# Altium schematic sheet pca10171_connectors.SchDoc: =BoardTitle + ' - Connectors'
size A3; Organization: Nordic Semiconductor; DocumentNumber: 7; SheetNumber: 7; SheetTotal: 10; CompanyName: Nordic Semiconductor; DocumentSize: A3
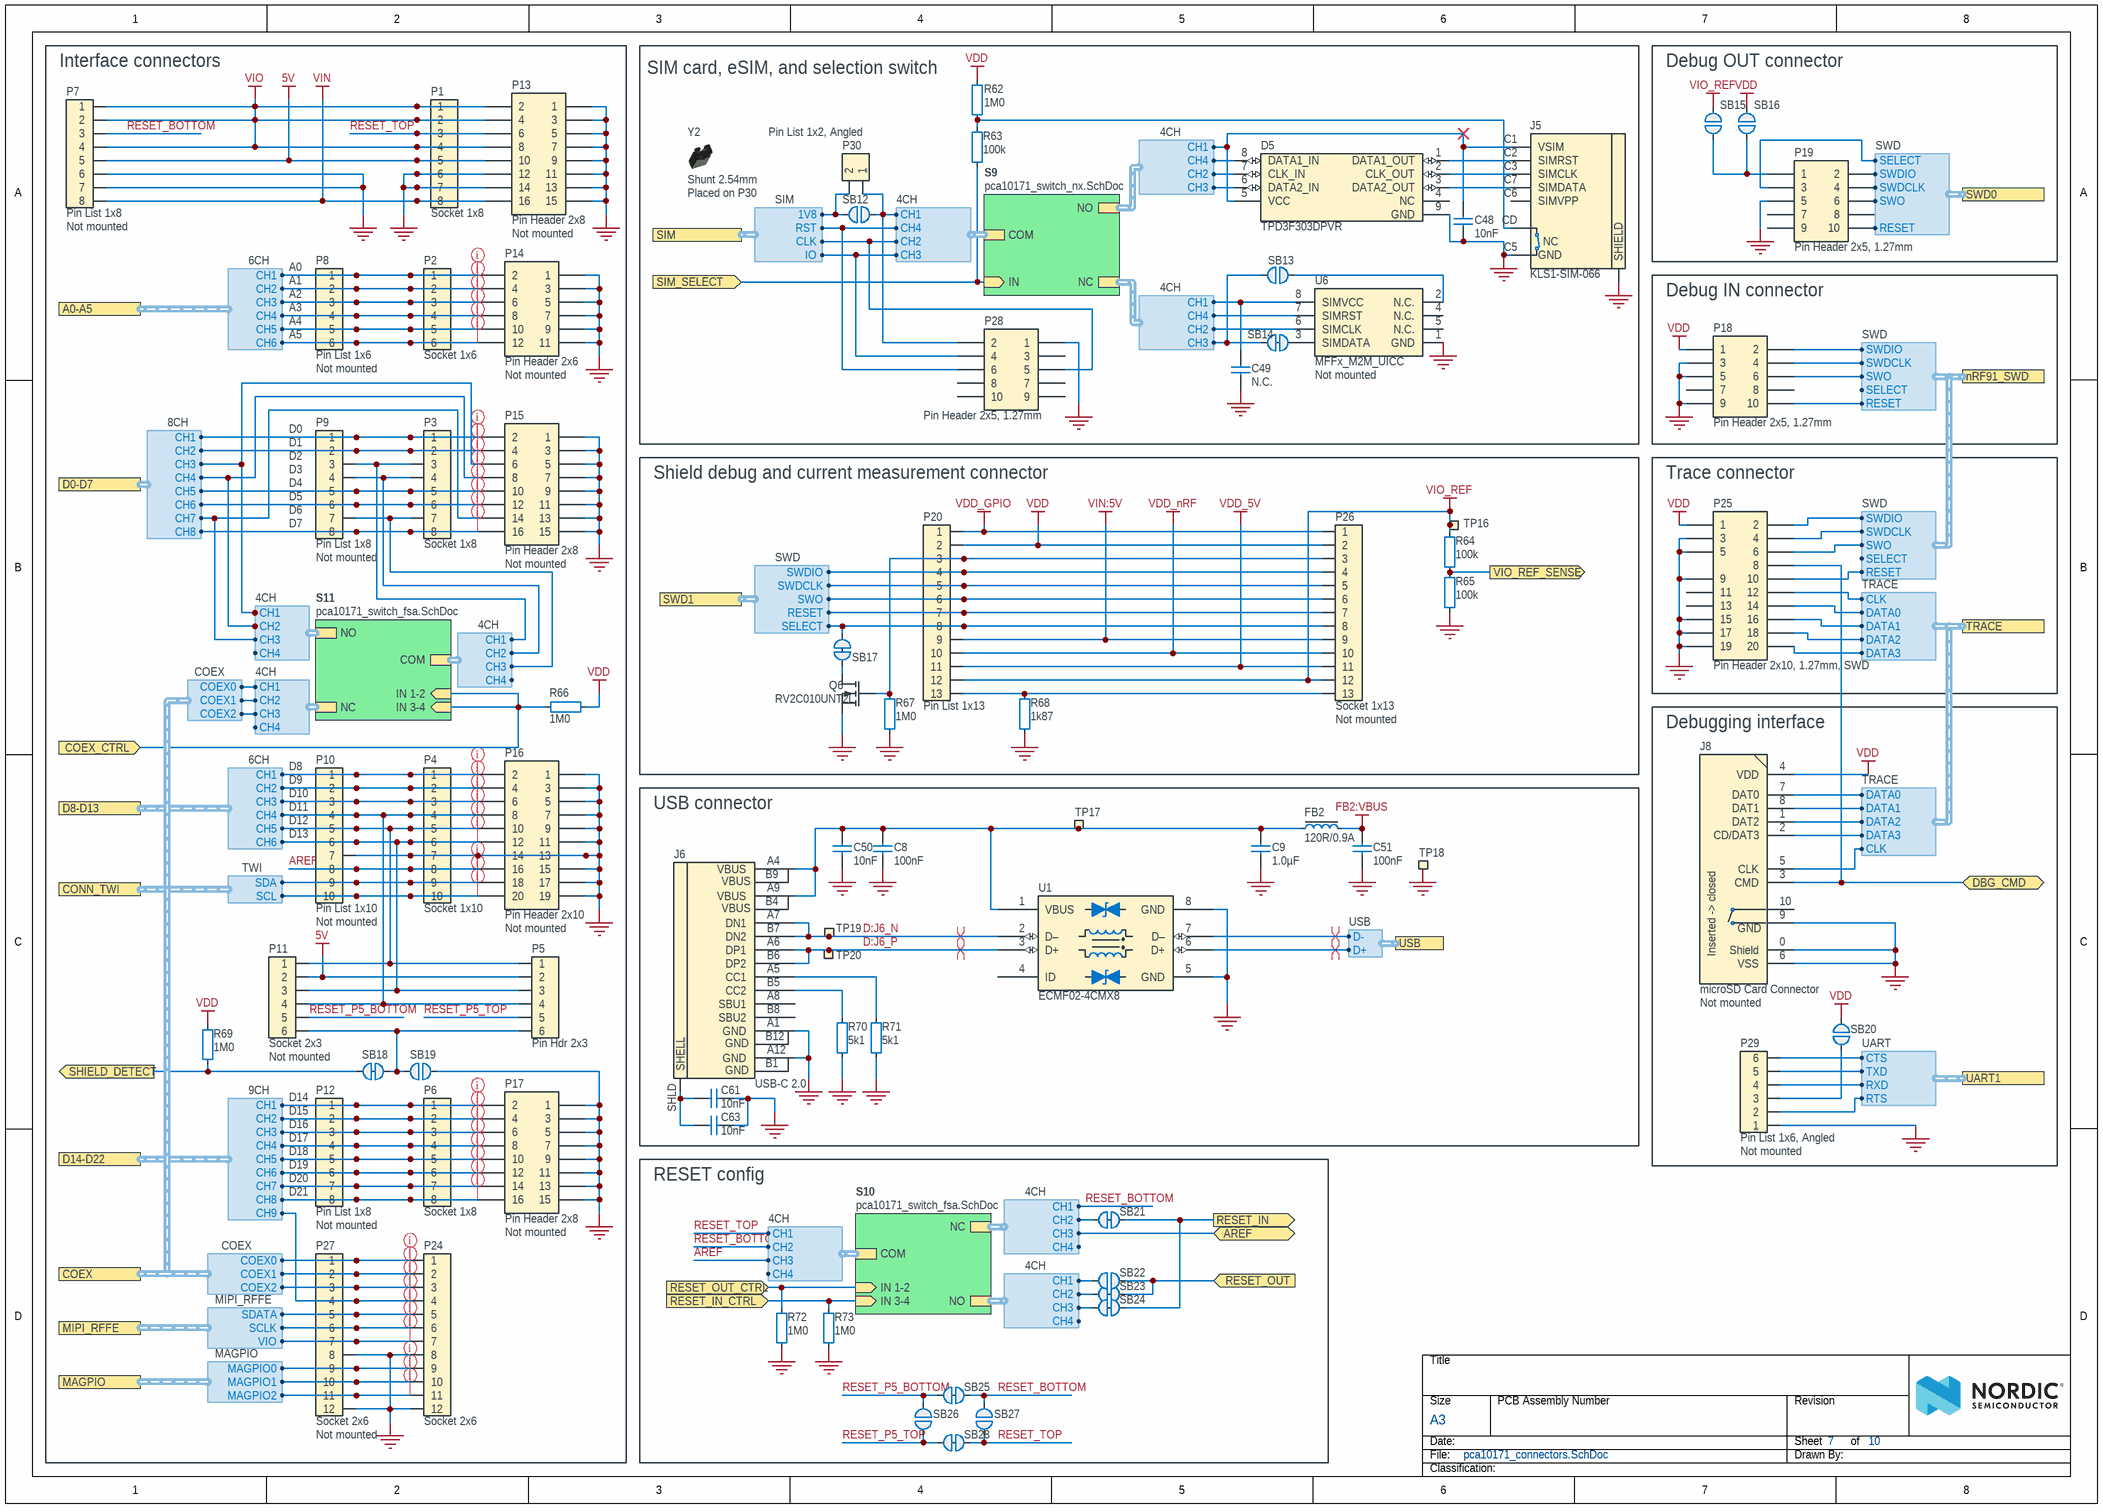
[diagram p0: pca10171_connectors.SchDoc]

## Parts
C8  100nF  [CAPC0603X03L_C]
C9  1.0µF  [CAPC1005X04L]
C48  10nF  [CAPC0603X03L_C]
C49  N.C.  [CAPC0603X03L_C_NC]
C50  10nF  [CAPC0603X03L_C]
C51  100nF  [CAPC0603X03L_C]
C61  10nF  [CAPC1005X04L]
C63  10nF  [CAPC1005X04L]
D5  TPD3F303DPVR  [SON50P210X160X65_HS-9N]
FB2  120R/0.9A  [INDC0603X03L_C]
J5  KLS1-SIM-066  [KLS1-SIM-066]
J6  USB-C 2.0  [SD-80259-001]
J8  microSD Card Connector  Assembly: Not mounted  [Molex_502774-0891]
P1  Socket 1x8  [SOCKET_1x8_SMD]
P2  Socket 1x6  [SOCKET_1x6_SMD]
P3  Socket 1x8  [SOCKET_1x8_SMD]
P4  Socket 1x10  [SOCKET_1x10_SMD]
P5  Pin Hdr 2x3  [HDR_2x3-SMD]
P6  Socket 1x8  [SOCKET_1x8_SMD]
P7  Pin List 1x8  Assembly: Not mounted  [LIST_1x8_SMD-NC]
P8  Pin List 1x6  Assembly: Not mounted  [LIST_1x6_SMD-NC]
P9  Pin List 1x8  Assembly: Not mounted  [LIST_1x8_SMD-NC]
P10  Pin List 1x10  Assembly: Not mounted  [LIST_1x10_SMD-NC]
P11  Socket 2x3  Assembly: Not mounted  [SOCKET_2x3_SMD-2.54mm-bottom-NC]
P12  Pin List 1x8  Assembly: Not mounted  [LIST_1x8_SMD-NC]
P13  Pin Header 2x8  Assembly: Not mounted  [HDR_2x8-NC]
P14  Pin Header 2x6  Assembly: Not mounted  [HDR_2x6-NC]
P15  Pin Header 2x8  Assembly: Not mounted  [HDR_2x8-NC]
P16  Pin Header 2x10  Assembly: Not mounted  [HDR_2x10-NC]
P17  Pin Header 2x8  Assembly: Not mounted  [HDR_2x8-NC]
P18  Pin Header 2x5, 1.27mm  [HDR_2x5-SMD-1.27mm-K]
P19  Pin Header 2x5, 1.27mm  [HDR_2x5-SMD-1.27mm-K]
P20  Pin List 1x13  [LIST_1x13_SMD]
P24  Socket 2x6  [SOCKET_2x6_SMD-2.54mm]
P25  Pin Header 2x10, 1.27mm, SWD  [HDR_2x10-SMD-1.27mm-K-SWD]
P26  Socket 1x13  Assembly: Not mounted  [LIST_1x13_SMD-NC]
P27  Socket 2x6  Assembly: Not mounted  [SOCKET_2x6_SMD-2.54mm]
P28  Pin Header 2x5, 1.27mm  [HDR_2x5-SMD-1.27mm]
P29  Pin List 1x6, Angled  Assembly: Not mounted  [LIST_ANG_1x6-SMD-2.54MM]
P30  Pin List 1x2, Angled  [LIST_ANG_1x2-SMD-2.54MM]
Q6  RV2C010UNT2L  [DFN65P100X40-3L]
R62  1M0  [RESC0603X03L_C]
R63  100k  [RESC0603X03L_C]
R64  100k  [RESC0603X03L_C]
R65  100k  [RESC0603X03L_C]
R66  1M0  [RESC0603X03L_C]
R67  1M0  [RESC0603X03L_C]
R68  1k87  [RESC0603X03L_C]
R69  1M0  [RESC0603X03L_C]
R70  5k1  [RESC0603X03L_C]
R71  5k1  [RESC0603X03L_C]
R72  1M0  [RESC0603X03L_C]
R73  1M0  [RESC0603X03L_C]
SB12  Solderbridge  [Solderbridge]  (value not drawn)  (no BOM)
SB13  Solderbridge  [Solderbridge]  (value not drawn)  (no BOM)
SB14  Solderbridge  [Solderbridge_Shorted]  (value not drawn)  (net tie, no BOM)
SB15  Solderbridge  [Solderbridge]  (value not drawn)  (no BOM)
SB16  Solderbridge  [Solderbridge]  (value not drawn)  (no BOM)
SB17  Solderbridge  [Solderbridge_Shorted]  (value not drawn)  (net tie, no BOM)
SB18  Solderbridge  [Solderbridge_Shorted]  (value not drawn)  (net tie, no BOM)
SB19  Solderbridge  [Solderbridge]  (value not drawn)  (no BOM)
SB20  Solderbridge  [Solderbridge]  (value not drawn)  (no BOM)
SB21  Solderbridge  [Solderbridge_Shorted]  (value not drawn)  (net tie, no BOM)
SB22  Solderbridge  [Solderbridge]  (value not drawn)  (no BOM)
SB23  Solderbridge  [Solderbridge_Shorted]  (value not drawn)  (net tie, no BOM)
SB24  Solderbridge  [Solderbridge_Shorted]  (value not drawn)  (net tie, no BOM)
SB25  Solderbridge  [Solderbridge_Shorted]  (value not drawn)  (net tie, no BOM)
SB26  Solderbridge  [Solderbridge]  (value not drawn)  (no BOM)
SB27  Solderbridge  [Solderbridge]  (value not drawn)  (no BOM)
SB28  Solderbridge  [Solderbridge_Shorted]  (value not drawn)  (net tie, no BOM)
TP16  Ø1.5mm,SMD  [TP_SMD_D1.5mm]  (value not drawn)  (no BOM)
TP17  Ø1.5mm,SMD  [TP_SMD_D1.5mm]  (value not drawn)  (no BOM)
TP18  Ø1.5mm,SMD  [TP_SMD_D1.5mm]  (value not drawn)  (no BOM)
TP19  Ø1.5mm,SMD  [TP_SMD_D1.5mm]  (value not drawn)  (no BOM)
TP20  Ø1.5mm,SMD  [TP_SMD_D1.5mm]  (value not drawn)  (no BOM)
U1  ECMF02-4CMX8  [UFDFN50P120X250X55-8N]
U6  MFFx_M2M_UICC  Assembly: Not mounted  [SON127P600X90_HS-8N]
Y2  Shunt 2.54mm  Assembly: Placed on P30  [Shunt_2.54mm_Horizontal]

## Blocks framed on the sheet
Interface connectors: P1-P17 P24 P27 R66 R69 SB18 SB19
SIM card, eSIM, and selection switch: C48 C49 D5 J5 P28 P30 R62 R63 SB12-SB14 U6 Y2
Debug OUT connector: P19 SB15 SB16
Debug IN connector: P18
Shield debug and current measurement connector: P20 P26 Q6 R64 R65 R67 R68 SB17 TP16
Trace connector: P25
Debugging interface: J8 P29 SB20
USB connector: C8 C9 C50 C51 C61 C63 FB2 J6 R70 R71 TP17-TP20 U1
RESET config: R72 R73 SB21-SB28

## Sub-sheets
S9 = pca10171_switch_nx.SchDoc: IN (in), COM (harness 4CH), NC (harness 4CH), NO (harness 4CH)
S10 = pca10171_switch_fsa.SchDoc: IN 1-2 (in), COM (harness 4CH), NC (harness 4CH), NO (harness 4CH), IN 3-4 (in)
S11 = pca10171_switch_fsa.SchDoc: IN 1-2 (in), COM (harness 4CH), NC (harness 4CH), NO (harness 4CH), IN 3-4 (in)

## Ports
A0-A5 (harness 6CH), AREF (bidir), COEX (harness COEX), COEX_CTRL (in), CONN_TWI (harness TWI), D0-D7 (harness 8CH), D8-D13 (harness 6CH), D14-D22 (harness 9CH), DBG_CMD (bidir), MAGPIO (harness MAGPIO), MIPI_RFFE (harness MIPI_RFFE), nRF91_SWD (harness SWD), RESET_IN (out), RESET_IN_CTRL (in), RESET_OUT (in), RESET_OUT_CTRL (in), SHIELD_DETECT (out), SIM (harness SIM), SIM_SELECT (in), SWD0 (harness SWD), SWD1 (harness SWD), TRACE (harness TRACE), UART1 (harness UART), USB (harness USB), VIO_REF_SENSE (out)

## Harnesses
SWD: SWDIO, SWDCLK, SWO, RESET, SELECT
6CH: CH1, CH2, CH3, CH4, CH5, CH6
8CH: CH1, CH2, CH3, CH4, CH5, CH6, CH7, CH8
COEX: COEX0, COEX2, COEX1
TRACE: CLK, DATA0, DATA1, DATA3, DATA2
USB: D+, D-
UART: RTS, CTS, RXD, TXD
MIPI_RFFE: SDATA, VIO, SCLK
MAGPIO: MAGPIO0, MAGPIO2, MAGPIO1
TWI: SCL, SDA
9CH: CH1, CH2, CH3, CH4, CH5, CH6, CH7, CH8, CH9
4CH: CH1, CH2, CH3, CH4
SIM: CLK, IO, 1V8, RST

## Nets
5V: P1.5 P5.2 P7.5 P11.2 P13.10
FB2:VBUS: C51.2 FB2.2
GND: C8.1 C9.1 C48.2 C49.1 C50.1 C51.1 C61.2 C63.2 D5.9(GND) J5.0(SHIELD) J5.C5(GND) J6.A1(GND) J6.A12(GND) J8.0(Shield) J8.6(VSS) J8.9 P1.6 P1.7 P4.7 P7.6 P7.7 P10.7 P13.1 P13.3 P13.5 P13.7 P13.9 P13.11 P13.12 P13.13 P13.14 P13.15 P14.1 P14.3 P14.5 P14.7 P14.9 P14.11 P15.1 P15.3 P15.5 P15.7 P15.9 P15.11 P15.13 P15.15 P16.1 P16.3 P16.5 P16.7 P16.9 P16.11 P16.13 P16.14 P16.15 P16.17 P16.19 P17.1 P17.3 P17.5 P17.7 P17.9 P17.11 P17.13 P17.15 P18.3 P18.5 P18.9 P19.5 P24.8 P24.12 P25.3 P25.5 P25.9 P25.15 P25.17 P25.19 P27.8 P27.12 P28.1 P29.1 Q6.2(S) R65.1 R67.2 R68.1 R70.1 R71.1 R72.2 R73.1 SB19.1 TP18.1 U1.5(GND) U1.8(GND) U6.1(GND)
VDD: J8.4(VDD) P18.1 P20.2 P25.1 P26.2 R62.1 R66.1 R69.2 SB16.2 SB20.1
VDD_5V: P20.11 P26.11
VDD_GPIO: P20.1 P26.1
VDD_nRF: P20.10 P26.10
VIN: P1.8 P7.8 P13.16
VIN:5V: P20.9 P26.9
VIO: P1.1 P1.2 P1.4 P7.1 P7.2 P7.4 P13.2 P13.4 P13.8
VIO_REF: P20.12 P26.12 R64.1 SB15.2 TP16.1
AREF: P4.8 P10.8 P16.16 ; sheet S10/COM.CH3
AREF: port AREF, sheet S10/NC.CH3  [a separate net that carries the same name]
COEX_CTRL: R66.2 ; port COEX_CTRL, sheet S11/IN 1-2, sheet S11/IN 3-4
D:J6_N: J6.A7(DN1) J6.B7(DN2) TP19.1 U1.2(D–)
D:J6_P: J6.A6(DP1) J6.B6(DP2) TP20.1 U1.3(D+)
DBG_CMD: J8.3(CMD) P25.8 ; port DBG_CMD
RESET_BOTTOM: P7.3 SB25.1 SB27.1 ; sheet S10/NC.CH1, sheet S10/COM.CH2
RESET_IN: SB21.2 SB24.2 ; port RESET_IN
RESET_IN_CTRL: R73.2 ; port RESET_IN_CTRL, sheet S10/IN 3-4
RESET_OUT: SB22.1 SB23.1 ; port RESET_OUT
RESET_OUT_CTRL: R72.1 ; port RESET_OUT_CTRL, sheet S10/IN 1-2
RESET_P5_BOTTOM: P11.5 SB25.2 SB26.2
RESET_P5_TOP: P5.5 SB26.1 SB28.2
RESET_TOP: P1.3 P13.6 SB27.2 SB28.1 ; sheet S10/COM.CH1
SHIELD_DETECT: R69.1 SB18.2 ; port SHIELD_DETECT
SIM_SELECT: R63.1 ; port SIM_SELECT, sheet S9/IN
VIO_REF_SENSE: R64.2 R65.2 ; port VIO_REF_SENSE
NetC8_2: C8.2 C9.2 C50.2 FB2.1 J6.A4(VBUS) J6.A9(VBUS) TP17.1 U1.1(VBUS)
NetC48_1: C48.1 D5.5(VCC) J5.C1(VSIM) ; sheet S9/NO.CH1
NetC49_2: C49.2 U6.8(SIMVCC) ; sheet S9/NC.CH1
NetC61_1: C61.1 C63.1 J6.SHLD(SHELL)
NetD5_1: D5.1(DATA1_OUT) J5.C2(SIMRST)
NetD5_2: D5.2(CLK_OUT) J5.C3(SIMCLK)
NetD5_3: D5.3(DATA2_OUT) J5.C7(SIMDATA)
NetD5_6: D5.6(DATA2_IN) ; sheet S9/NO.CH3
NetD5_7: D5.7(CLK_IN) ; sheet S9/NO.CH2
NetD5_8: D5.8(DATA1_IN) ; sheet S9/NO.CH4
NetJ5_CD: J5.CD R62.2 R63.2
NetJ6_A5: J6.A5(CC1) R71.2
NetJ6_B5: J6.B5(CC2) R70.2
NetJ8_1: J8.1(DAT2) P25.18 ; port TRACE.DATA2
NetJ8_2: J8.2(CD/DAT3) P25.20 ; port TRACE.DATA3
NetJ8_5: J8.5(CLK) P25.12 ; port TRACE.CLK
NetJ8_7: J8.7(DAT0) P25.14 ; port TRACE.DATA0
NetJ8_8: J8.8(DAT1) P25.16 ; port TRACE.DATA1
NetP2_1: P2.1 P8.1 P14.2 ; port A0-A5.CH1
NetP2_2: P2.2 P8.2 P14.4 ; port A0-A5.CH2
NetP2_3: P2.3 P8.3 P14.6 ; port A0-A5.CH3
NetP2_4: P2.4 P8.4 P14.8 ; port A0-A5.CH4
NetP2_5: P2.5 P8.5 P14.10 ; port A0-A5.CH5
NetP2_6: P2.6 P8.6 P14.12 ; port A0-A5.CH6
NetP3_1: P3.1 P9.1 P15.2 ; port D0-D7.CH1
NetP3_2: P3.2 P9.2 P15.4 ; port D0-D7.CH2
NetP3_3: P3.3 P9.3 ; sheet S11/COM.CH1
NetP3_4: P3.4 P9.4 ; sheet S11/COM.CH2
NetP3_5: P3.5 P9.5 P15.10 ; port D0-D7.CH5
NetP3_6: P3.6 P9.6 P15.12 ; port D0-D7.CH6
NetP3_7: P3.7 P9.7 ; sheet S11/COM.CH3
NetP3_8: P3.8 P9.8 P15.16 ; port D0-D7.CH8
NetP4_1: P4.1 P10.1 P16.2 ; port D8-D13.CH1
NetP4_2: P4.2 P10.2 P16.4 ; port D8-D13.CH2
NetP4_3: P4.3 P10.3 P16.6 ; port D8-D13.CH3
NetP4_4: P4.4 P5.4 P10.4 P11.4 P16.8 ; port D8-D13.CH4
NetP4_5: P4.5 P5.1 P10.5 P11.1 P16.10 ; port D8-D13.CH5
NetP4_6: P4.6 P5.3 P10.6 P11.3 P16.12 ; port D8-D13.CH6
NetP4_9: P4.9 P10.9 P16.18 ; port CONN_TWI.SDA
NetP4_10: P4.10 P10.10 P16.20 ; port CONN_TWI.SCL
NetP5_6: P5.6 P11.6 SB18.1 SB19.2
NetP6_1: P6.1 P12.1 P17.2 ; port D14-D22.CH1
NetP6_2: P6.2 P12.2 P17.4 ; port D14-D22.CH2
NetP6_3: P6.3 P12.3 P17.6 ; port D14-D22.CH3
NetP6_4: P6.4 P12.4 P17.8 ; port D14-D22.CH4
NetP6_5: P6.5 P12.5 P17.10 ; port D14-D22.CH5
NetP6_6: P6.6 P12.6 P17.12 ; port D14-D22.CH6
NetP6_7: P6.7 P12.7 P17.14 ; port D14-D22.CH7
NetP6_8: P6.8 P12.8 P17.16 ; port D14-D22.CH8
NetP15_6: P15.6 ; port D0-D7.CH3, sheet S11/NO.CH1
NetP15_8: P15.8 ; port D0-D7.CH4, sheet S11/NO.CH2
NetP15_14: P15.14 ; port D0-D7.CH7, sheet S11/NO.CH3
NetP18_2: P18.2 P25.2 ; port nRF91_SWD.SWDIO
NetP18_4: P18.4 P25.4 ; port nRF91_SWD.SWDCLK
NetP18_6: P18.6 P25.6 ; port nRF91_SWD.SWO
NetP18_10: P18.10 P25.10 ; port nRF91_SWD.RESET
NetP19_1: P19.1 SB15.1 SB16.1
NetP19_2: P19.2 ; port SWD0.SWDIO
NetP19_3: P19.3 ; port SWD0.SELECT
NetP19_4: P19.4 ; port SWD0.SWDCLK
NetP19_6: P19.6 ; port SWD0.SWO
NetP19_10: P19.10 ; port SWD0.RESET
NetP20_3: P20.3 P26.3 Q6.1(G) R67.1
NetP20_4: P20.4 P26.4 ; port SWD1.SWDIO
NetP20_5: P20.5 P26.5 ; port SWD1.SWDCLK
NetP20_6: P20.6 P26.6 ; port SWD1.SWO
NetP20_7: P20.7 P26.7 ; port SWD1.RESET
NetP20_8: P20.8 P26.8 SB17.2 ; port SWD1.SELECT
NetP20_13: P20.13 P26.13 R68.2
NetP24_1: P24.1 P27.1 ; port COEX.COEX0, sheet S11/NC.CH1
NetP24_2: P24.2 P27.2 ; port COEX.COEX1, sheet S11/NC.CH2
NetP24_3: P24.3 P27.3 ; port COEX.COEX2, sheet S11/NC.CH3
NetP24_4: P24.4 P27.4 ; port D14-D22.CH9
NetP24_5: P24.5 P27.5 ; port MIPI_RFFE.SDATA
NetP24_6: P24.6 P27.6 ; port MIPI_RFFE.SCLK
NetP24_7: P24.7 P27.7 ; port MIPI_RFFE.VIO
NetP24_9: P24.9 P27.9 ; port MAGPIO.MAGPIO0
NetP24_10: P24.10 P27.10 ; port MAGPIO.MAGPIO1
NetP24_11: P24.11 P27.11 ; port MAGPIO.MAGPIO2
NetP28_2: P28.2 P30.1 SB12.2 ; sheet S9/COM.CH1
NetP28_4: P28.4 ; sheet S9/COM.CH3, port SIM.IO
NetP28_5: P28.5 ; sheet S9/COM.CH2, port SIM.CLK
NetP28_6: P28.6 ; sheet S9/COM.CH4, port SIM.RST
NetP29_2: P29.2 ; port UART1.RTS
NetP29_3: P29.3 SB20.2
NetP29_4: P29.4 ; port UART1.RXD
NetP29_5: P29.5 ; port UART1.TXD
NetP29_6: P29.6 ; port UART1.CTS
NetP30_2: P30.2 SB12.1 ; port SIM.1V8
NetQ6_3: Q6.3(D) SB17.1
NetSB13_1: SB13.1 U6.2(N.C.)
NetSB13_2: SB13.2 SB14.2 ; sheet S9/NC.CH3
NetSB14_1: SB14.1 U6.3(SIMDATA)
NetSB21_1: SB21.1 ; sheet S10/NC.CH2
NetSB22_2: SB22.2 ; sheet S10/NO.CH1
NetSB23_2: SB23.2 ; sheet S10/NO.CH2
NetSB24_1: SB24.1 ; sheet S10/NO.CH3
NetU1_6: U1.6(D+) ; port USB.D+
NetU1_7: U1.7(D–) ; port USB.D-
NetU6_6: U6.6(SIMCLK) ; sheet S9/NC.CH2
NetU6_7: U6.7(SIMRST) ; sheet S9/NC.CH4

Not connected (* = marked no-connect by the designer): D5 4(NC); J5 C6(SIMVPP); J6 A8(SBU1) B8(SBU2); J8 10; P18 7 8; P19 7 8 9; P25 11 13; P28 3 7 8 9 10; U1 4(ID); U6 4(N.C.) 5(N.C.)

## Layout directives
net class GPIO: AREF, NetP2_1, NetP2_2, NetP2_3, NetP2_4, NetP2_5, NetP2_6, NetP3_1, NetP3_2, NetP3_5, NetP3_6, NetP3_8, NetP4_1, NetP4_2, NetP4_3, NetP4_4, NetP4_5, NetP4_6, NetP4_9, NetP4_10, NetP6_1, NetP6_2, NetP6_3, NetP6_4, NetP6_5, NetP6_6, NetP6_7, NetP6_8, NetP15_6, NetP15_8, NetP15_14, NetP24_1, NetP24_2, NetP24_3, NetP24_4, NetP24_5, NetP24_6, NetP24_7, NetP24_9, NetP24_10, NetP24_11
differential pair; differential pair class D:J6; net class USB: D:J6_N, D:J6_P
differential pair; differential pair class IMCU; net class USB: NetU1_6, NetU1_7

## Notes on the sheet
- (near P8) A0
- (near P8) A1
- (near P8) A2
- (near P8) A3
- (near P8) A4
- (near P8) A5
- (near P9) D0
- (near P9) D1
- (near P9) D2
- (near P9) D3
- (near P9) D4
- (near P9) D5
- (near P9) D6
- (near P9) D7
- (near P10) D8
- (near P10) D9
- (near P10) D10
- (near P10) D11
- (near P10) D12
- (near P10) D13
- (near P12) D14
- (near P12) D15
- (near P12) D16
- (near P12) D17
- (near P12) D18
- (near P12) D19
- (near P12) D20
- (near P12) D21
- Title
- Size
- Date:
- File:
- PCB Assembly Number
- Sheet         of
- Drawn By:
- Revision
- Classification:
- (in symbol 80259-1021) B9; B4; B12; B1
- (in symbol L-KLS1-SIM-066-(6+1)P-H1.37-R) NC
- (in symbol Molex_502774-0891) GND; Inserted -> closed

## Library data of the parts
C8 C51 = C0201-100n: Capacitor, X5R, ±10%; Manufacturer: N.A.; Part number IPS: 00000001248, 00000002505; Part number Norautron: 262071862; Part number NEMS: 100200078; Note: 16V; Pad Count: 2; Component Status: Active; Part Number: C0201-100n; Manufacturer Part Number: N.A.; LatestRevisionDate: 2017-11-09; Published: 2014-11-13; Value: 100nF; Artikkelnr Noca: N.A.; Footprint Doc: 0201; ComponentLink1URL: N.A.; ComponentLink1Description: Datasheet; ComponentLink2URL: N.A.; ComponentLink2Description: Supplier link; HelpURL: N.A.; Supplier 1: N.A.; Supplier Part Number 1: N.A.; Supplier 2: N.A.; Supplier Part Number 2: N.A.; Component Class: Capacitors; PartId: 100200078; Author: rsk
C9 = C0402-1µ0-16V-X5R: Capacitor, Ceramic, X5R, ±10%, 16V; Manufacturer: Murata; Manufacturer Part Number: GRT155R61C105KE01D; Part number NEMS: 100200452; Artikkelnr Noca: N.A.; Pad Count: 2; Component Status: Active; Part Number: C0402-1µ0-16V-X5R; Footprint Doc: 0402; LatestRevisionDate: 2020-12-15; Published: 2020-12-15; Value: 1.0µF; Note: 16V; Part number IPS: N.A.; ComponentLink1URL: https://search.murata.co.jp/Ceramy/image/img/A01X/G101/ENG/GRT155R61C105KE01-01.pdf; ComponentLink1Description: Datasheet; ComponentLink2URL: https://www.murata.com/en-global/products/productdetail?partno=GRT155R61C105KE01%23; ComponentLink2Description: Supplier link; HelpURL: N.A.; Supplier 1: Digi-Key; Supplier Part Number 1: 490-12255-1-ND; Supplier 2: Mouser; Supplier Part Number 2: 81-GRT155R61C105KE1D; Component Class: Capacitors; PartId: 100200452; Author: rsk; Part number Norautron: N.A.
C48 C50 = C0201-10n: Capacitor, X7R, ±10%; Manufacturer: N.A.; Part number IPS: 00000003480; Part number Norautron: 26621779; Part number NEMS: 100200067; Note: 10V; Pad Count: 2; Component Status: Active; Part Number: C0201-10n; Manufacturer Part Number: N.A.; ComponentLink1URL: N.A.; ComponentLink1Description: Datasheet; ComponentLink2URL: N.A.; ComponentLink2Description: Supplier link; HelpURL: N.A.; Footprint Doc: 0201; LatestRevisionDate: 2017-11-09; Published: 2014-11-13; Value: 10nF; Artikkelnr Noca: N.A.; Supplier 1: N.A.; Supplier Part Number 1: N.A.; Supplier 2: N.A.; Supplier Part Number 2: N.A.; PartId: 100200067; Component Class: Capacitors; Author: rsk
C49 = C0201-N.C.: Not mounted; Manufacturer: N.A.; Part number NEMS: 100200001; Note: Chip Cap; Assembly: Not mounted; Pad Count: 2; Component Status: Active; Part Number: C0201-N.C.; Manufacturer Part Number: N.A.; ComponentLink1URL: N.A.; ComponentLink1Description: Datasheet; ComponentLink2URL: N.A.; ComponentLink2Description: Supplier link; HelpURL: N.A.; Footprint Doc: 0201; LatestRevisionDate: 2014-11-13; Published: 2014-11-13; Value: N.C.; Artikkelnr Noca: N.A.; Part number IPS: N.A.; Supplier 1: N.A.; Supplier Part Number 1: N.A.; Supplier 2: N.A.; Supplier Part Number 2: N.A.; PartId: 100200001; Component Class: Capacitors; Author: rsk; Part number Norautron: N.A.
C61 C63 = C0402-10n: Capacitor, X7R, ±10%; Manufacturer: N.A.; Part number IPS: 00000007784; Part number NEMS: 100200173; Component Status: Active; Pad Count: 2; Note: 16V; Artikkelnr Noca: 20039166; Part Number: C0402-10n; PartId: 100200173; Component Class: Capacitors; Author: rsk; Manufacturer Part Number: N.A.; ComponentLink1URL: N.A.; ComponentLink1Description: Datasheet; ComponentLink2URL: N.A.; ComponentLink2Description: Supplier link; HelpURL: N.A.; LatestRevisionDate: 2009-11-23; Published: 2009-05-08; Footprint Doc: 0402; Value: 10nF; Supplier 1: N.A.; Supplier Part Number 1: N.A.; Supplier 2: N.A.; Supplier Part Number 2: N.A.; Part number Norautron: N.A.
D5 = TPD3F303DPVR: ESD Protection and EMI Filter for SIM Card Interface; Manufacturer: Texas Instruments; Part number NEMS: 101900729; Note: N.A.; Pad Count: 8; Component Status: Active; Part Number: TPD3F303DPVR; Manufacturer Part Number: TPD3F303DPVR; Footprint Doc: USON-8; LatestRevisionDate: 2022-10-19; Published: 2022-10-19; Value: TPD3F303DPVR; Artikkelnr Noca: N.A.; ComponentLink1URL: https://www.ti.com/lit/ds/symlink/tpd3f303.pdf; ComponentLink1Description: Datasheet; ComponentLink2URL: https://www.digikey.com/en/products/detail/texas-instruments/TPD3F303DPVR/2605055; ComponentLink2Description: Supplier link; HelpURL: https://www.ti.com/product/TPD3F303/part-details/TPD3F303DPVR; Supplier 1: Digi-Key; Supplier Part Number 1: 296-28299-1-ND; Supplier 2: Mouser; Supplier Part Number 2: 595-TPD3F303DPVR; Part number IPS: N.A.; PartId: 101900729; Component Class: Misc_ICs; Author: rubr; Part number Norautron: N.A.
FB2 = FB0201-120R@100M-900mA-BLM03PX121SN1D: Ferrite Bead, 120 Ohm @ 100MHz, 900mA, 160 mOhm Max; Manufacturer: Murata; Part number NEMS: 100300405; Component Status: Active; Pad Count: 2; Note: N.A.; Part Number: FB0201-120R@100M-900mA-BLM03PX121SN1D; PartId: 100300405; Component Class: Inductors; Author: rubr; Manufacturer Part Number: BLM03PX121SN1D; ComponentLink1URL: https://www.murata.com/en-us/products/productdata/8796741140510/ENFA0020.pdf; ComponentLink1Description: Datasheet; ComponentLink2URL: N.A.; ComponentLink2Description: Supplier link; HelpURL: N.A.; LatestRevisionDate: 2022-01-19; Published: 2022-01-19; Footprint Doc: 0201; Value: 120R/0.9A; Supplier 1: Digi-Key; Supplier Part Number 1: 490-BLM03PX121SN1DTR-ND; Supplier 2: N.A.; Supplier Part Number 2: N.A.; Artikkelnr Noca: N.A.; Part number IPS: N.A.; Part number Norautron: N.A.
J5 = L-KLS1-SIM-066-(6+1)P-H1.37-R: Nano SIM Card Connector, Push-Push, 6-Pin, H1.37mm, with CD Pin; Manufacturer: KLS Electronic; Part number NEMS: 100500776; Note: N.A.; Pad Count: 7; Component Status: Active; Part Number: L-KLS1-SIM-066-(6+1)P-H1.37-R; Manufacturer Part Number: L-KLS1-SIM-066-(6+1)P-H1.37-R; Footprint Doc: KLS1-SIM-066; LatestRevisionDate: 2023-01-01; Published: 2023-01-01; Value: KLS1-SIM-066; Artikkelnr Noca: N.A.; Part number IPS: N.A.; ComponentLink1URL: https://klsele.com/admin/product_upload/20190123133741L-KLS1-SIM-066-(6+1)P-H1.37-R--.pdf; ComponentLink1Description: Datasheet; ComponentLink2URL: N.A.; ComponentLink2Description: Supplier link; HelpURL: https://klsele.com/products/connectors/SIM-card-connectors-Micro-SIM-card-connectors-Nano-SIM-Card-Connectors/4918.html; Supplier 1: Cabcon; Supplier Part Number 1: L-KLS1-SIM-066-(6+1)P-H1.37-R; Supplier 2: N.A.; Supplier Part Number 2: N.A.; Component Class: Connectors; Author: rubr; Part number Norautron: N.A.; System: Connector; PartId: 100500776
J6 = 80259-1021: USB-C Receptacle, 16 Pin, USB 2.0; Manufacturer: Bellweather Electronic Corp.; Part number NEMS: 100500830; Component Status: Active; Pad Count: 16; Note: N.A.; System: Connector; Part Number: 80259-1021; PartId: 100500830; Component Class: Connectors; Author: getr; Manufacturer Part Number: 80259-1021; ComponentLink1URL: \\hizz\pro\app9717\Datasheet\connectors\Bellwether\SD-80259-001_C.pdf; ComponentLink1Description: Datasheet; ComponentLink2URL: N.A.; ComponentLink2Description: Supplier link; HelpURL: N.A.; LatestRevisionDate: 2024-03-26; Published: 2023-10-30; Footprint Doc: SD-80259-001; Value: USB-C 2.0; Supplier 1: Cabcon; Supplier Part Number 1: 80259-1021; Supplier 2: N.A.; Supplier Part Number 2: N.A.; Artikkelnr Noca: N.A.; Part number IPS: N.A.; Part number Norautron: N.A.
J8 = Molex_502774-0891: 1.10mm Pitch microSD Memory Card Connector, Reverse Mount Surface Mount, Push-Push Type; Manufacturer: Molex; Part number IPS: 00000001284; Part number NEMS: 100500509; Note: N.A.; Pad Count: 14; Component Status: Active; Part Number: Molex_502774-0891; Manufacturer Part Number: 502774-0891; ComponentLink1URL: http://www.molex.com/pdm_docs/sd/5027740891_sd.pdf; ComponentLink1Description: Datasheet; ComponentLink2URL: N.A.; ComponentLink2Description: Supplier link; HelpURL: https://www.molex.com/molex/products/part-detail/memory_card_socket/5027740891; Footprint Doc: Molex 502774-0891; LatestRevisionDate: 2020-02-06; Published: 2017-11-08; Value: microSD Card Connector; Artikkelnr Noca: N.A.; Supplier 1: Digi-Key; Supplier Part Number 1: WM24066CT-ND; Supplier 2: Elfa; Supplier Part Number 2: 300-76-403; PartId: 100500509; Component Class: Connectors; Author: rsk; Part number Norautron: N.A.; System: Connector
P1 P3 P6 = Socket 1x8 SMD: Socket 1x8, 2.54mm (100mil), SMD; Manufacturer: WCON; Manufacturer Part Number: 2171-108MS0CUNR1; Part number IPS: 00000009963; Part number Norautron: 26032369; Part number NEMS: 100500412; Note: N.A.; Artikkelnr Noca: 55030002; Pad Count: 8; Component Status: Active; System: Connector; Part Number: Socket 1x8 SMD; Footprint Doc: SOCKET_1x8_SMD; LatestRevisionDate: 2017-10-23; Published: 2016-01-22; Value: Socket 1x8; ComponentLink1URL: N.A.; ComponentLink1Description: Datasheet; ComponentLink2URL: N.A.; ComponentLink2Description: Supplier link; HelpURL: N.A.; Supplier 1: Cabcon; Supplier Part Number 1: 2171-108MS0CUNR1; Supplier 2: Samtec; Supplier Part Number 2: SSM-108-F-SV-P-TR; PartId: 100500412; Component Class: Connectors; Author: rsk
P2 = Socket 1x6 SMD: Socket 1x6, 2.54mm (100mil), SMD; Manufacturer: WCON; Manufacturer Part Number: 2171-106MS0CUNR1; Part number IPS: 00000009964; Part number Norautron: 26032370; Part number NEMS: 100500408; Note: N.A.; Artikkelnr Noca: 55030001; Pad Count: 6; Component Status: Active; System: Connector; Part Number: Socket 1x6 SMD; Footprint Doc: SOCKET_1x6_SMD; LatestRevisionDate: 2017-10-23; Published: 2016-01-22; Value: Socket 1x6; ComponentLink1URL: N.A.; ComponentLink1Description: Datasheet; ComponentLink2URL: N.A.; ComponentLink2Description: Supplier link; HelpURL: N.A.; Supplier 1: Cabcon; Supplier Part Number 1: 2171-106MS0CUNR1; Supplier 2: Samtec; Supplier Part Number 2: SSM-106-F-SV-P-TR; PartId: 100500408; Component Class: Connectors; Author: rsk
P4 = Socket 1x10 SMD: Socket 1x10, 2.54mm (100mil), SMD; Manufacturer: WCON; Manufacturer Part Number: 2171-110MS0CUNR1; Part number IPS: 00000009965; Part number Norautron: 26032371; Part number NEMS: 100500416; Note: N.A.; Artikkelnr Noca: 55030004; Pad Count: 10; Component Status: Active; System: Connector; Part Number: Socket 1x10 SMD; Footprint Doc: SOCKET_1x10_SMD; LatestRevisionDate: 2016-01-22; Published: 2016-01-22; Value: Socket 1x10; ComponentLink1URL: N.A.; ComponentLink1Description: Datasheet; ComponentLink2URL: N.A.; ComponentLink2Description: Supplier link; HelpURL: N.A.; Supplier 1: Cabcon; Supplier Part Number 1: 2171-110MS0CUNR1; Supplier 2: Samtec; Supplier Part Number 2: SSM-110-F-SV-P-TR; PartId: 100500416; Component Class: Connectors; Author: rsk
P5 = Pin Header 2x3 SMD: Pin Header 2x3, 2.54mm (100mil) SMD; Manufacturer: WCON; Manufacturer Part Number: 1125-1203S0M116R1; Part number IPS: 00000009966; Part number Norautron: N.A.; Part number NEMS: 100500242; Artikkelnr Noca: 55010007; Pad Count: 6; Component Status: Active; System: Connector; Part Number: Pin Header 2x3 SMD; Footprint Doc: HDR_2x3-SMD; LatestRevisionDate: 2016-01-22; Published: 2016-01-22; Value: Pin Hdr 2x3; Note: SMD; ComponentLink1URL: N.A.; ComponentLink1Description: Datasheet; ComponentLink2URL: N.A.; ComponentLink2Description: Supplier link; HelpURL: \\hizz\pro\app9717\Datasheet\connectors\W-CON\1125-12XXXXMXXXXX.PDF; Supplier 1: Cabcon; Supplier Part Number 1: 1125-1203S0M116R1; Supplier 2: Samtec; Supplier Part Number 2: TSM-103-01-L-DV; PartId: 100500242; Component Class: Connectors; Author: rsk
P7 P9 P12 = Pin List 1x8 SMD, N.C.: Pin List 1x8, 2.54mm (100mil), SMD; Manufacturer: WCON; Manufacturer Part Number: 1125-1108S0M116R2; Part number NEMS: 100500330; Note: N.A.; Artikkelnr Noca: 55010006; Pad Count: 8; Component Status: Active; System: Connector; Part Number: Pin List 1x8 SMD, N.C.; LatestRevisionDate: 2016-01-22; Published: 2016-01-22; Value: Pin List 1x8; Footprint Doc: LIST_1x8_SMD; Part number IPS: N.A.; ComponentLink1URL: N.A.; ComponentLink1Description: Datasheet; ComponentLink2URL: N.A.; ComponentLink2Description: Supplier link; HelpURL: \\hizz\pro\app9717\Datasheet\connectors\W-CON\1125-11XXXXMXXXXX.pdf; Supplier 1: Cabcon; Supplier Part Number 1: 1125-1108S0M116R2; Supplier 2: Samtec; Supplier Part Number 2: TSM-108-01-L-SV-P-TR; PartId: 100500330; Component Class: Connectors; Author: rsk; Part number Norautron: N.A.
P8 = Pin List 1x6 SMD, N.C.: Pin List 1x6, 2.54mm (100mil), SMD; Manufacturer: WCON; Manufacturer Part Number: 1125-1106S0M116R2; Part number NEMS: 100500321; Note: N.A.; Artikkelnr Noca: 55010026; Pad Count: 6; Component Status: Active; System: Connector; Part Number: Pin List 1x6 SMD, N.C.; LatestRevisionDate: 2016-03-29; Published: 2016-03-29; Value: Pin List 1x6; Footprint Doc: LIST_1x6_SMD; Part number IPS: N.A.; ComponentLink1URL: N.A.; ComponentLink1Description: Datasheet; ComponentLink2URL: N.A.; ComponentLink2Description: Supplier link; HelpURL: \\hizz\pro\app9717\Datasheet\connectors\W-CON\1125-11XXXXMXXXXX.pdf; Supplier 1: Cabcon; Supplier Part Number 1: 1125-1106S0M116R2; Supplier 2: Samtec; Supplier Part Number 2: TSM-106-01-L-SV-P-TR; PartId: 100500321; Component Class: Connectors; Author: rsk; Part number Norautron: N.A.
P10 = Pin List 1x10 SMD, N.C.: Pin List 1x10, 2.54mm (100mil), SMD; Manufacturer: WCON; Manufacturer Part Number: 1125-1110S0M116R2; Part number NEMS: 100500338; Note: N.A.; Artikkelnr Noca: 55010028; Pad Count: 10; Component Status: Active; System: Connector; Part Number: Pin List 1x10 SMD, N.C.; LatestRevisionDate: 2016-03-29; Published: 2016-03-29; Value: Pin List 1x10; Footprint Doc: LIST_1x10_SMD; Part number IPS: N.A.; ComponentLink1URL: N.A.; ComponentLink1Description: Datasheet; ComponentLink2URL: N.A.; ComponentLink2Description: Supplier link; HelpURL: \\hizz\pro\app9717\Datasheet\connectors\W-CON\1125-11XXXXMXXXXX.pdf; Supplier 1: Cabcon; Supplier Part Number 1: 1125-1110S0M116R2; Supplier 2: Samtec; Supplier Part Number 2: TSM-110-01-L-SV-P-TR; PartId: 100500338; Component Class: Connectors; Author: rsk; Part number Norautron: N.A.
P11 = Socket 2x3 SMD Bottom, N.C.: Socket 2x3, 2.54mm (100mil), SMD; Manufacturer: WCON; Manufacturer Part Number: 2171-203MS0CUNR1; Part number NEMS: 100500434; Note: N.A.; Artikkelnr Noca: 55030010; Pad Count: 6; Component Status: Active; System: Connector; Part Number: Socket 2x3 SMD Bottom, N.C.; LatestRevisionDate: 2016-03-29; Published: 2014-06-10; Value: Socket 2x3; Footprint Doc: SOCKET_2x3_SMD-2.54mm-bottom; Part number IPS: N.A.; ComponentLink1URL: N.A.; ComponentLink1Description: Datasheet; ComponentLink2URL: N.A.; ComponentLink2Description: Supplier link; HelpURL: \\hizz\pro\app9717\Datasheet\connectors\W-CON\2171-2XXMXXCUNXX.pdf; Supplier 1: Cabcon; Supplier Part Number 1: 2171-203MS0CUNR1; Supplier 2: Samtec; Supplier Part Number 2: SSM-103-F-DV-P-TR; PartId: 100500434; Component Class: Connectors; Author: rsk; Part number Norautron: N.A.
P13 P15 P17 = Pin Header 2x8, N.C.: Pin Header 2x8, 2.54mm (100mil); Manufacturer: N.A.; Part number NEMS: 100500270; Pad Count: 16; Component Status: Active; System: Connector; Part Number: Pin Header 2x8, N.C.; Manufacturer Part Number: N.A.; Footprint Doc: HDR_2x8; LatestRevisionDate: 2009-12-12; Published: 2009-12-12; Value: Pin Header 2x8; Note: N.A.; Artikkelnr Noca: N.A.; Part number IPS: N.A.; ComponentLink1URL: N.A.; ComponentLink1Description: Datasheet; ComponentLink2URL: N.A.; ComponentLink2Description: Supplier link; HelpURL: N.A.; Supplier 1: N.A.; Supplier Part Number 1: N.A.; Supplier 2: N.A.; Supplier Part Number 2: N.A.; PartId: 100500270; Component Class: Connectors; Author: rsk; Part number Norautron: N.A.
P14 = Pin Header 2x6, N.C.: Pin Header 2x6, 2.54mm (100mil); Manufacturer: N.A.; Part number NEMS: 100500265; Pad Count: 12; Component Status: Active; System: Connector; Part Number: Pin Header 2x6, N.C.; Manufacturer Part Number: N.A.; Footprint Doc: HDR_2x6; LatestRevisionDate: 2014-07-04; Published: 2009-12-12; Value: Pin Header 2x6; Note: N.A.; Artikkelnr Noca: N.A.; Part number IPS: N.A.; ComponentLink1URL: N.A.; ComponentLink1Description: Datasheet; ComponentLink2URL: N.A.; ComponentLink2Description: Supplier link; HelpURL: N.A.; Supplier 1: N.A.; Supplier Part Number 1: N.A.; Supplier 2: N.A.; Supplier Part Number 2: N.A.; PartId: 100500265; Component Class: Connectors; Author: rsk; Part number Norautron: N.A.
P16 = Pin Header 2x10, N.C.: Pin Header 2x10, 2.54mm (100mil); Manufacturer: N.A.; Part number NEMS: 100500274; Pad Count: 20; Component Status: Active; System: Connector; Part Number: Pin Header 2x10, N.C.; Manufacturer Part Number: N.A.; Footprint Doc: HDR_2x10; LatestRevisionDate: 2017-02-02; Published: 2017-01-30; Value: Pin Header 2x10; Note: N.A.; Artikkelnr Noca: N.A.; Part number IPS: N.A.; ComponentLink1URL: N.A.; ComponentLink1Description: Datasheet; ComponentLink2URL: N.A.; ComponentLink2Description: Supplier link; HelpURL: N.A.; Supplier 1: N.A.; Supplier Part Number 1: N.A.; Supplier 2: N.A.; Supplier Part Number 2: N.A.; PartId: 100500274; Component Class: Connectors; Author: rsk; Part number Norautron: N.A.
P18 P19 = Pin Header 2x5 SMD, 1.27mm, KS: Pin Header 2x5, 1.27mm (50mil), SMD, Keying Shroud; Manufacturer: WCON; Manufacturer Part Number: 3132-10MS0BK00R1; Part number IPS: 00000009968; Part number NEMS: 100500261; Note: N.A.; Artikkelnr Noca: 55010009; Pad Count: 10; Component Status: Active; System: Connector; Part Number: Pin Header 2x5 SMD, 1.27mm, KS; Footprint Doc: HDR_2x5-SMD-1.27mm; LatestRevisionDate: 2016-04-21; Published: 2016-01-22; Value: Pin Header 2x5, 1.27mm; ComponentLink1URL: N.A.; ComponentLink1Description: Datasheet; ComponentLink2URL: N.A.; ComponentLink2Description: Supplier link; HelpURL: \\hizz\pro\app9717\Datasheet\connectors\W-CON\3132-XXMXXBK00XX.pdf; Supplier 1: Cabcon; Supplier Part Number 1: 3132-10MS0BK00R1; Supplier 2: Samtec; Supplier Part Number 2: FTSH-105-01-F-DV-K; PartId: 100500261; Component Class: Connectors; Author: rsk; Part number Norautron: N.A.
P20 = Pin List 1x13 SMD: Pin List 1x13, 2.54mm (100mil), SMD; Manufacturer: N.A.; Part number IPS: 00000002499; Part number NEMS: 100500345; Pad Count: 13; Component Status: Active; System: Connector; Part Number: Pin List 1x13 SMD; Manufacturer Part Number: N.A.; Footprint Doc: LIST_1x13_SMD; LatestRevisionDate: 2015-11-10; Published: 2015-11-10; Value: Pin List 1x13; Note: N.A.; Artikkelnr Noca: N.A.; ComponentLink1URL: N.A.; ComponentLink1Description: Datasheet; ComponentLink2URL: N.A.; ComponentLink2Description: Supplier link; HelpURL: N.A.; Supplier 1: Cabcon; Supplier Part Number 1: 1125-1113S0M116R2; Supplier 2: Samtec; Supplier Part Number 2: TSM-113-01-L-SV-P-TR; PartId: 100500345; Component Class: Connectors; Author: rsk; Part number Norautron: N.A.
P24 P27 = Socket 2x6 SMD: Socket 2x6, 2.54mm (100mil), SMD; Manufacturer: WCON; Manufacturer Part Number: 2171-206MS0CUNR1; Part number NEMS: 100500439; Note: N.A.; Pad Count: 12; Component Status: Active; System: Connector; Part Number: Socket 2x6 SMD; ComponentLink1URL: N.A.; ComponentLink1Description: Datasheet; ComponentLink2URL: N.A.; ComponentLink2Description: Supplier link; HelpURL: N.A.; Footprint Doc: SOCKET_2x6_SMD-2.54mm; LatestRevisionDate: 2019-04-12; Published: 2019-04-12; Value: Socket 2x6; Artikkelnr Noca: N.A.; Part number IPS: N.A.; Supplier 1: Cabcon; Supplier Part Number 1: 2171-206MS0CUNR1; Supplier 2: Samtec; Supplier Part Number 2: SSM-106-F-DV-P-TR; PartId: 100500439; Component Class: Connectors; Author: rsk; Part number Norautron: N.A.
P25 = Pin Header 2x10 SMD, 1.27mm, KS, SWD (Cabcon): Pin Header 2x10, 1.27mm (50mil), SMD, Keying Shroud, Removed Pin 7; Manufacturer: WCON; Manufacturer Part Number: 3132-20MS0BK00R3; Part number NEMS: 100500841,100500280; Note: N.A.; Pad Count: 19; Component Status: Active; System: Connector; Part Number: Pin Header 2x10 SMD, 1.27mm, KS, SWD (Cabcon); LatestRevisionDate: 2023-12-14; Published: 2023-12-14; Value: Pin Header 2x10, 1.27mm, SWD; Artikkelnr Noca: N.A.; Footprint Doc: HDR_2x10-SMD-1.27mm-SWD; Part number IPS: N.A.; ComponentLink1URL: N.A.; ComponentLink1Description: Datasheet; ComponentLink2URL: N.A.; ComponentLink2Description: Supplier link; HelpURL: N.A.; Supplier 1: Cabcon; Supplier Part Number 1: 3132-20MS0BK00R3; Supplier 2: N.A.; Supplier Part Number 2: N.A.; PartId: 100500841; Component Class: Connectors; Author: kod1; Part number Norautron: N.A.
P26 = Socket 1x13 SMD, N.C.: Socket 1x13, 2.54mm (100mil), SMD; Manufacturer: WCON; Manufacturer Part Number: 2171-113MS0CUNR1; Part number NEMS: 100500422; Note: N.A.; Pad Count: 13; Component Status: Active; System: Connector; Part Number: Socket 1x13 SMD, N.C.; Footprint Doc: SOCKET_1x13_SMD; LatestRevisionDate: 2019-05-27; Published: 2019-05-27; Value: Socket 1x13; Artikkelnr Noca: N.A.; Part number IPS: N.A.; ComponentLink1URL: N.A.; ComponentLink1Description: Datasheet; ComponentLink2URL: N.A.; ComponentLink2Description: Supplier link; HelpURL: N.A.; Supplier 1: Cabcon; Supplier Part Number 1: 2171-113MS0CUNR1; Supplier 2: Samtec; Supplier Part Number 2: SSM-113-L-SV-P-TR; PartId: 100500422; Component Class: Connectors; Author: rsk; Part number Norautron: N.A.
P28 = Pin Header 2x5 SMD, 1.27mm: Pin Header 2x5, 1.27mm (50mil), SMD; Manufacturer: WCON; Manufacturer Part Number: 1325-1205S0M078R1; Part number IPS: 00000009970; Part number NEMS: 100500259; Note: N.A.; Artikkelnr Noca: 55019196; Pad Count: 10; Component Status: Active; System: Connector; Part Number: Pin Header 2x5 SMD, 1.27mm; Footprint Doc: HDR_2x5-SMD-1.27mm; LatestRevisionDate: 2016-04-21; Published: 2010-11-25; Value: Pin Header 2x5, 1.27mm; ComponentLink1URL: N.A.; ComponentLink1Description: Datasheet; ComponentLink2URL: N.A.; ComponentLink2Description: Supplier link; HelpURL: http://www.farnell.com/datasheets/81359.pdf; Supplier 1: Cabcon; Supplier Part Number 1: 1325-1205S0M078R1; Supplier 2: Farnell; Supplier Part Number 2: 166-7759; PartId: 100500259; Component Class: Connectors; Author: rsk; Part number Norautron: N.A.
P29 = Pin List Ang 1x6 SMD, 2.54mm: Pin List 1x6, 2.54mm (100mil), Right Angled, SMD; Manufacturer: N.A.; Part number IPS: 00000003922; Part number NEMS: 100500362; Pad Count: 6; Component Status: Active; System: Connector; Part Number: Pin List Ang 1x6 SMD, 2.54mm; Manufacturer Part Number: N.A.; ComponentLink1URL: N.A.; ComponentLink1Description: Datasheet; ComponentLink2URL: N.A.; ComponentLink2Description: Supplier link; HelpURL: N.A.; Footprint Doc: LIST_ANG_1x6-SMD-2.54MM; LatestRevisionDate: 2020-04-28; Published: 2015-01-23; Value: Pin List 1x6, Angled; Note: N.A.; Supplier 1: Samtec; Supplier Part Number 1: TSM-106-01-L-SH-A; Supplier 2: Digi-Key; Supplier Part Number 2: S1113E-06-ND; Artikkelnr Noca: N.A.; PartId: 100500362; Component Class: Connectors; Author: rsk; Part number Norautron: N.A.
P30 = Pin List Ang 1x2 SMD, 2.54mm: Pin List 1x2, 2.54mm (100mil), Right Angled, SMD; Manufacturer: WCON; Manufacturer Part Number: 1125B-1102S0Z135R2; Part number IPS: 00000009972; Part number NEMS: 100500354; Note: N.A.; Artikkelnr Noca: 55010023; Pad Count: 2; Component Status: Active; System: Connector; Part Number: Pin List Ang 1x2 SMD, 2.54mm; ComponentLink1URL: N.A.; ComponentLink1Description: Datasheet; ComponentLink2URL: N.A.; ComponentLink2Description: Supplier link; HelpURL: \\hizz\pro\app9717\Datasheet\connectors\W-CON\1125B-11XXXXZXXXXX.pdf; Footprint Doc: LIST_ANG_1x2-SMD-2.54MM; LatestRevisionDate: 2016-05-26; Published: 2016-01-22; Value: Pin List 1x2, Angled; Supplier 1: Cabcon; Supplier Part Number 1: 1125B-1102S0Z135R2; Supplier 2: Samtec; Supplier Part Number 2: TSM-102-01-L-SH-A; PartId: 100500354; Component Class: Connectors; Author: rsk; Part number Norautron: N.A.
Q6 = RV2C010UNT2L: N-Channel MOSFET, 20V, 1A, 470mOhm, 400mW; Manufacturer: Rohm Semiconductor; Part number IPS: 00000009976; Part number Norautron: 26320026; Part number NEMS: 101300132; Note: N.A.; Artikkelnr Noca: 35010020; Pad Count: 3; Component Status: Active; Part Number: RV2C010UNT2L; Manufacturer Part Number: RV2C010UNT2L; ComponentLink1URL: N.A.; ComponentLink1Description: Datasheet; ComponentLink2URL: N.A.; ComponentLink2Description: Supplier link; HelpURL: http://rohmfs.rohm.com/en/products/databook/datasheet/discrete/transistor/mosfet/rv2c010unt2l-e.pdf; Footprint Doc: DFN-3; LatestRevisionDate: 2016-08-09; Published: 2016-08-09; Value: RV2C010UNT2L; Supplier 1: Digi-Key; Supplier Part Number 1: RV2C010UNT2LCT-ND; Supplier 2: Mouser; Supplier Part Number 2: 755-RV2C010UNT2L; PartId: 101300132; Component Class: Semiconductors; Author: rsk
R62 R66 R67 R69 R72 R73 = R0201-1M0: Resistor, ±1%, 0.05W; Manufacturer: N.A.; Part number IPS: 00000001418; Part number Norautron: 26107108; Part number NEMS: 100100093; Note: Chip Res 1%; Pad Count: 2; Component Status: Active; Part Number: R0201-1M0; Manufacturer Part Number: N.A.; ComponentLink1URL: N.A.; ComponentLink1Description: Datasheet; ComponentLink2URL: N.A.; ComponentLink2Description: Supplier link; HelpURL: N.A.; Footprint Doc: 0201; LatestRevisionDate: 2014-11-13; Published: 2014-11-13; Value: 1M0; Artikkelnr Noca: N.A.; Supplier 1: N.A.; Supplier Part Number 1: N.A.; Supplier 2: N.A.; Supplier Part Number 2: N.A.; PartId: 100100093; Component Class: Resistors; Author: rsk
R63-R65 = R0201-100k: Resistor, ±1%, 0.05W; Manufacturer: N.A.; Part number IPS: 00000001419; Part number Norautron: 26108487; Part number NEMS: 100100080; Note: Chip Res 1%; Pad Count: 2; Component Status: Active; Part Number: R0201-100k; Manufacturer Part Number: N.A.; ComponentLink1URL: N.A.; ComponentLink1Description: Datasheet; ComponentLink2URL: N.A.; ComponentLink2Description: Supplier link; HelpURL: N.A.; Footprint Doc: 0201; LatestRevisionDate: 2014-11-13; Published: 2014-11-13; Value: 100k; Artikkelnr Noca: N.A.; Supplier 1: N.A.; Supplier Part Number 1: N.A.; Supplier 2: N.A.; Supplier Part Number 2: N.A.; PartId: 100100080; Component Class: Resistors; Author: rsk
R68 = R0201-1k87: Resistor, ±1%, 0.05W; Manufacturer: N.A.; Part number NEMS: 100100050; Note: Chip Res 1%; Pad Count: 2; Component Status: Active; Part Number: R0201-1k87; Manufacturer Part Number: N.A.; ComponentLink1URL: N.A.; ComponentLink1Description: Datasheet; ComponentLink2URL: N.A.; ComponentLink2Description: Supplier link; HelpURL: N.A.; Footprint Doc: 0201; LatestRevisionDate: 2019-07-16; Published: 2019-07-16; Value: 1k87; Artikkelnr Noca: N.A.; Part number IPS: N.A.; Supplier 1: N.A.; Supplier Part Number 1: N.A.; Supplier 2: N.A.; Supplier Part Number 2: N.A.; PartId: 100100050; Component Class: Resistors; Author: rsk; Part number Norautron: N.A.
R70 R71 = R0201-5k1: Resistor, ±1%, 0.05W; Manufacturer: N.A.; Part number Norautron: 26192285; Part number NEMS: 100100565; Pad Count: 2; Note: Chip Res 1%; Component Status: Active; Part Number: R0201-5k1; PartId: 100100565; Component Class: Resistors; Author: rsk; Manufacturer Part Number: N.A.; ComponentLink1URL: N.A.; ComponentLink1Description: Datasheet; ComponentLink2URL: N.A.; ComponentLink2Description: Supplier link; HelpURL: N.A.; Footprint Doc: 0201; LatestRevisionDate: 2016-04-20; Published: 2016-04-20; Value: 5k1; Supplier 1: N.A.; Supplier Part Number 1: N.A.; Supplier 2: N.A.; Supplier Part Number 2: N.A.; Artikkelnr Noca: N.A.; Part number IPS: N.A.
SB12 SB13 SB15 SB16 SB19 SB20 SB22 SB26 SB27 = Solderbridge: Manufacturer: N.A.; Part number NEMS: 100500458; Pad Count: 2; Component Status: Active; System: Connector; Part Number: Solderbridge; Manufacturer Part Number: N.A.; ComponentLink1URL: N.A.; ComponentLink1Description: Datasheet; ComponentLink2URL: N.A.; ComponentLink2Description: Supplier link; HelpURL: N.A.; Footprint Doc: Solderbridge; LatestRevisionDate: 2009-12-14; Published: 2009-12-14; Value: Solderbridge; Note: N.A.; Supplier 1: N.A.; Supplier Part Number 1: N.A.; Supplier 2: N.A.; Supplier Part Number 2: N.A.; Artikkelnr Noca: N.A.; Part number IPS: N.A.; PartId: 100500458; Component Class: Connectors; Author: rsk; Part number Norautron: N.A.
SB14 SB18 SB21 SB23-SB25 SB28 = Solderbridge Shorted: Shorted Solderbridge; Manufacturer: N.A.; Part number NEMS: 100500459; Pad Count: 2; Component Status: Active; System: Connector; Part Number: Solderbridge Shorted; PartId: 100500459; Component Class: Connectors; Author: rsk; Manufacturer Part Number: N.A.; ComponentLink1URL: N.A.; ComponentLink1Description: Datasheet; ComponentLink2URL: N.A.; ComponentLink2Description: Supplier link; HelpURL: N.A.; Footprint Doc: Solderbridge_Shorted; LatestRevisionDate: 2012-08-07; Published: 2012-08-07; Value: Solderbridge; Note: N.A.; Supplier 1: N.A.; Supplier Part Number 1: N.A.; Supplier 2: N.A.; Supplier Part Number 2: N.A.; Artikkelnr Noca: N.A.; Part number IPS: N.A.; Part number Norautron: N.A.
SB17 = Solderbridge Shorted: Shorted Solderbridge; Manufacturer: N.A.; Part number NEMS: 100500459; Component Status: Active; Pad Count: 2; System: Connector; Part Number: Solderbridge Shorted; PartId: 100500459; Component Class: Connectors; Author: rsk; Manufacturer Part Number: N.A.; ComponentLink1URL: N.A.; ComponentLink1Description: Datasheet; ComponentLink2URL: N.A.; ComponentLink2Description: Supplier link; HelpURL: N.A.; LatestRevisionDate: 2012-08-07; Published: 2012-08-07; Footprint Doc: Solderbridge_Shorted; Value: Solderbridge; Note: N.A.; Supplier 1: N.A.; Supplier Part Number 1: N.A.; Supplier 2: N.A.; Supplier Part Number 2: N.A.; Artikkelnr Noca: N.A.; Part number IPS: N.A.; Part number Norautron: N.A.
TP16-TP20 = TP_SMD_Ø1.5MM: 1.5mm circular SMD testpad; Manufacturer: Nordic Semiconductor; Manufacturer Part Number: N.A.; Part number NEMS: 100500477; Pad Count: 1; Component Status: Active; Part Number: TP_SMD_Ø1.5MM; ComponentLink1URL: N.A.; ComponentLink1Description: Datasheet; ComponentLink2URL: N.A.; ComponentLink2Description: Supplier link; HelpURL: N.A.; Footprint Doc: TP_SMD_Ø1.5mm; LatestRevisionDate: 2021-03-05; Published: 2016-06-02; Value: Ø1.5mm,SMD; Note: N.A.; Artikkelnr Noca: N.A.; Part number IPS: N.A.; Supplier 1: N.A.; Supplier Part Number 1: N.A.; Supplier 2: N.A.; Supplier Part Number 2: N.A.; PartId: 100500477; Component Class: Connectors; Author: rsk; Part number Norautron: N.A.
U1 = ECMF02-4CMX8: 2 Line Common mode filter with ESD protection for USB 2.0 interface; Manufacturer: STMicroelectronics; Part number NEMS: 100800034; Component Status: Active; Pad Count: 8; Note: N.A.; Part Number: ECMF02-4CMX8; PartId: 100800034; Component Class: Filters; Author: eisk; Manufacturer Part Number: ECMF02-4CMX8; ComponentLink1URL: https://www.st.com/content/ccc/resource/technical/document/datasheet/group3/1c/93/cf/72/85/cf/4d/d6/DM00039389/files/DM00039389.pdf/jcr:content/translations/en.DM00039389.pdf; ComponentLink1Description: Datasheet; ComponentLink2URL: https://www.digikey.com/en/products/detail/stmicroelectronics/ECMF02-4CMX8/3770020; ComponentLink2Description: Supplier link; HelpURL: https://www.st.com/content/ccc/resource/technical/document/datasheet/group3/1c/93/cf/72/85/cf/4d/d6/DM00039389/files/DM00039389.pdf/jcr:content/translations/en.DM00039389.pdf; LatestRevisionDate: 2024-01-31; Published: 2024-01-31; Footprint Doc: UFDFN-8; Value: ECMF02-4CMX8; Supplier 1: Digi-Key; Supplier Part Number 1: 497-13420-2-ND; Supplier 2: Mouser; Supplier Part Number 2: 511-ECMF02-4CMX8; Artikkelnr Noca: N.A.; Part number IPS: N.A.; Part number Norautron: N.A.
U6 = M2M_UICC: M2M UICC SIM Card; Manufacturer: N.A.; Part number NEMS: 101900595; Pad Count: 8; Component Status: Active; Part Number: M2M_UICC; Manufacturer Part Number: N.A.; Value: M2M UICC; Footprint Doc: SON-8; Artikkelnr Noca: N.A.; ComponentLink1Description: Datasheet; ComponentLink1URL: N.A.; ComponentLink2Description: Supplier link; ComponentLink2URL: N.A.; HelpURL: N.A.; LatestRevisionDate: 2019-10-22; Note: N.A.; Part number IPS: N.A.; Published: 2019-10-22; Supplier 1: N.A.; Supplier 2: N.A.; Supplier Part Number 1: N.A.; Supplier Part Number 2: N.A.; PartId: 101900595; Component Class: Misc_ICs; Author: rsk; Part number Norautron: N.A.
Y2 = SHUNT JUMPER 2.54mm BLACK GOLD Horizontal (obsolete): Shunt Jumper 2.54mm Black; Manufacturer: 3M; Manufacturer Part Number: 969102-0000-DA; Part number IPS: 00000001916; Part number Norautron: N.A.; Part number NEMS: 100500644; Note: SHUNT JUMPER .1" BLACK GOLD, h=6.00mm, w=5.00mm; Artikkelnr Noca: 56099001; Pad Count: 2; System: Connector; Part Number: SHUNT JUMPER 2.54mm BLACK GOLD Horizontal (Obsolete); ComponentLink1URL: N.A.; ComponentLink1Description: Datasheet; ComponentLink2URL: N.A.; ComponentLink2Description: Supplier link; HelpURL: http://www.digikey.com/product-detail/en/969102-0000-DA; Footprint Doc: SHUNT JUMPER 2.54mm; LatestRevisionDate: 2021-06-28; Published: 2019-09-04; Value: Shunt 2.54mm; Supplier 1: Digi-Key; Supplier Part Number 1: 3M9580-ND; Supplier 2: N.A.; Supplier Part Number 2: N.A.; PartId: 100500644; Component Class: Connectors; Author: rsk; Component Status: Obsolete